# Altium project chassis.PrjPCB
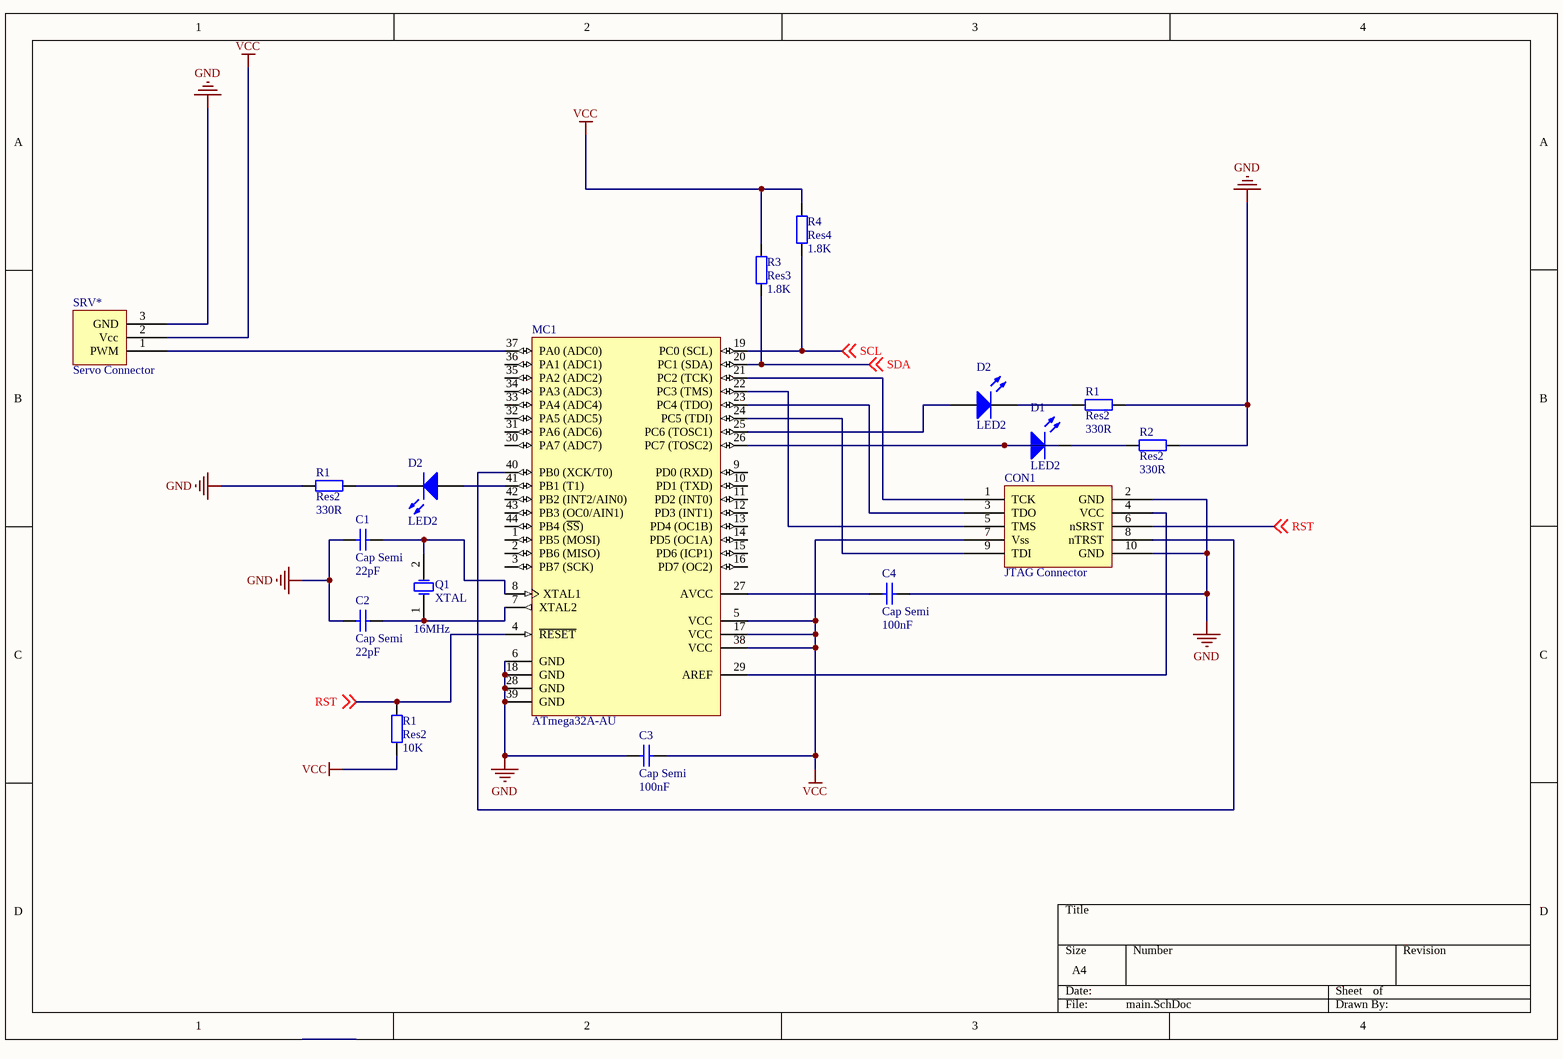
[diagram p0: main.SchDoc]
5 sheets, 60 parts. Net scope: global (net labels, ports and power ports of the same name join across sheets).
Sheets:
  main.SchDoc
  pwm_driver.SchDoc
  adc.SchDoc
  mpu.SchDoc
  main_arm.SchDoc

## Sheet main.SchDoc
size A4

### Parts
(Parts that share a designator on the sheet are numbered #1, #2 ... from top to bottom, then left to right.)
C1#1  Cap Semi  value 22pF  [C1206]
C2#1  Cap Semi  value 22pF  [C1206]
C3#1  Cap Semi  value 100nF  [C1206]
C4#1  Cap Semi  value 100nF  [C1206]
CON1  JTAG Connector
D1  LED2  [3.2X1.6X1.1]
D2#1  LED2  [3.2X1.6X1.1]
D2#2  LED2  [3.2X1.6X1.1]
MC1  ATmega32A-AU  [44A_N]
Q1  XTAL  Freq: 16MHz  [R38]
R1#1  Res2  value 330R  [AXIAL-0.4]
R1#2  Res2  value 330R  [AXIAL-0.4]
R1#3  Res2  value 10K  [AXIAL-0.4]
R2#1  Res2  value 330R  [AXIAL-0.4]
R3  Res3  value 1.8K  [AXIAL-0.4]
R4  Res4  value 1.8K  [AXIAL-0.4]
SRV*  Servo Connector

### Nets
GND: C1#1.1 C2#1.1 C3#1.1 C4#1.2 CON1.2(GND) CON1.10(GND) MC1.6(GND) MC1.18(GND) MC1.28(GND) MC1.39(GND) R1#1.1 R1#2.1 R2#1.1 SRV*.3(GND)
VCC: C3#1.2 CON1.7(Vss) MC1.5(VCC) MC1.17(VCC) MC1.38(VCC) R1#3.1 R3.1 R4.1 SRV*.2(Vcc)
RST: CON1.6(nSRST) MC1.4(~{RESET}) R1#3.2 ; off-sheet RST
SCL: MC1.19(PC0_(SCL)) R4.2 ; off-sheet SCL
SDA: MC1.20(PC1_(SDA)) R3.2 ; off-sheet SDA
NetC1#1_2: C1#1.2 MC1.8(XTAL1) Q1.2(OSC2)
NetC2#1_2: C2#1.2 MC1.7(XTAL2) Q1.1(OSC1)
NetC4#1_1: C4#1.1 MC1.27(AVCC)
NetCON1_1: CON1.1(TCK) MC1.21(PC2_(TCK))
NetCON1_3: CON1.3(TDO) MC1.23(PC4_(TDO))
NetCON1_4: CON1.4(VCC) MC1.29(AREF)
NetCON1_5: CON1.5(TMS) MC1.22(PC3_(TMS))
NetCON1_8: CON1.8(nTRST) MC1.40(PB0_(XCK/T0))
NetCON1_9: CON1.9(TDI) MC1.24(PC5_(TDI))
NetD1_1: D1.1(A) MC1.26(PC7_(TOSC2))
NetD1_2: D1.2(K) R2#1.2
NetD2#1_1: D2#1.1(A) MC1.25(PC6_(TOSC1))
NetD2#1_2: D2#1.2(K) R1#1.2
NetD2#2_1: D2#2.1(A) MC1.41(PB1_(T1))
NetD2#2_2: D2#2.2(K) R1#2.2
NetMC1_37: MC1.37(PA0_(ADC0)) SRV*.1(PWM)

Not connected (* = marked no-connect by the designer): MC1 1(PB5_(MOSI)) 2(PB6_(MISO)) 3(PB7_(SCK)) 9(PD0_(RXD)) 10(PD1_(TXD)) 11(PD2_(INT0)) 12(PD3_(INT1)) 13(PD4_(OC1B)) 14(PD5_(OC1A)) 15(PD6_(ICP1)) 16(PD7_(OC2)) 30(PA7_(ADC7)) 31(PA6_(ADC6)) 32(PA5_(ADC5)) 33(PA4_(ADC4)) 34(PA3_(ADC3)) 35(PA2_(ADC2)) 36(PA1_(ADC1)) 42(PB2_(INT2/AIN0)) 43(PB3_(OC0/AIN1)) 44(PB4_(~{SS}))

### Library data of the parts
C1#1 C2#1 C3#1 C4#1 = Cap Semi: Capacitor (Semiconductor SIM Model); Published: 8-Jun-2000; LatestRevisionDate: 29-May-2009; LatestRevisionNote: IPC-7351 Footprint Added.; PackageReference: C1206; Publisher: Altium Limited; PackageDescription: Chip Capacitor
D1 D2#1 D2#2 = LED2: Typical RED, GREEN, YELLOW, AMBER GaAs LED; Published: 8-Jun-2000; LatestRevisionDate: 17-Jul-2002; LatestRevisionNote: Re-released for DXP Platform.; PackageVersion: Feb-2002; PackageReference: 3.2X1.6X1.1; Publisher: Altium Limited; PackageDescription: SM LED; 2 Flat Leads
MC1 = ATmega32A-AU: 8-bit AVR Microcontroller, 2.7-5.5V, 16MHz, 32KB Flash, 1KB EEPROM, 2KB SRAM, 44-pin TQFP, Industrial Grade (-40°C to 85°C); FUSE bits: CKOPT = 0 , SU = 11 , CKSEL 3:0 = 1111; DatasheetVersion: revC, Feb-2011; PackageVersion: revC, Oct-2010; PackageReference: 44A; PackageDescription: 44-Pin Plastic Thin Profile Quad Flat Pack, 10 x 10 x 1.0 mm Body, 0.8 mm Pitch (TQFP); Code_JEDEC: MS-026-ACB; ComponentLink1Description: Manufacturer URL; ComponentLink1URL: http://www.atmel.com/; ComponentLink2Description: ATmega32A Datasheet; ComponentLink2URL: http://www.atmel.com/dyn/resources/prod_documents/doc8155.pdf; ComponentLink3Description: ATmega32A Summary; ComponentLink3URL: http://www.atmel.com/dyn/resources/prod_documents/8155S.pdf
Q1 = XTAL: Crystal Oscillator; Published: 8-Jun-2000; LatestRevisionDate: 17-Jul-2002; LatestRevisionNote: Re-released for DXP Platform.; PackageReference: R38; Publisher: Altium Limited; PackageDescription: Crystal, Thru-Hole; 2 Leads; Body 3.1 x 8.2 mm (Dia.xH)
R1#1-R1#3 R2#1 R3 R4 = Res2: Resistor; Published: 8-Jun-2000; LatestRevisionDate: 17-Jul-2002; LatestRevisionNote: Re-released for DXP Platform.; PackageReference: AXIAL-0.4; Publisher: Altium Limited; PackageDescription: Axial Device, Thru-Hole; 2 Leads; 0.4 in Pin Spacing

## Sheet pwm_driver.SchDoc
size A4
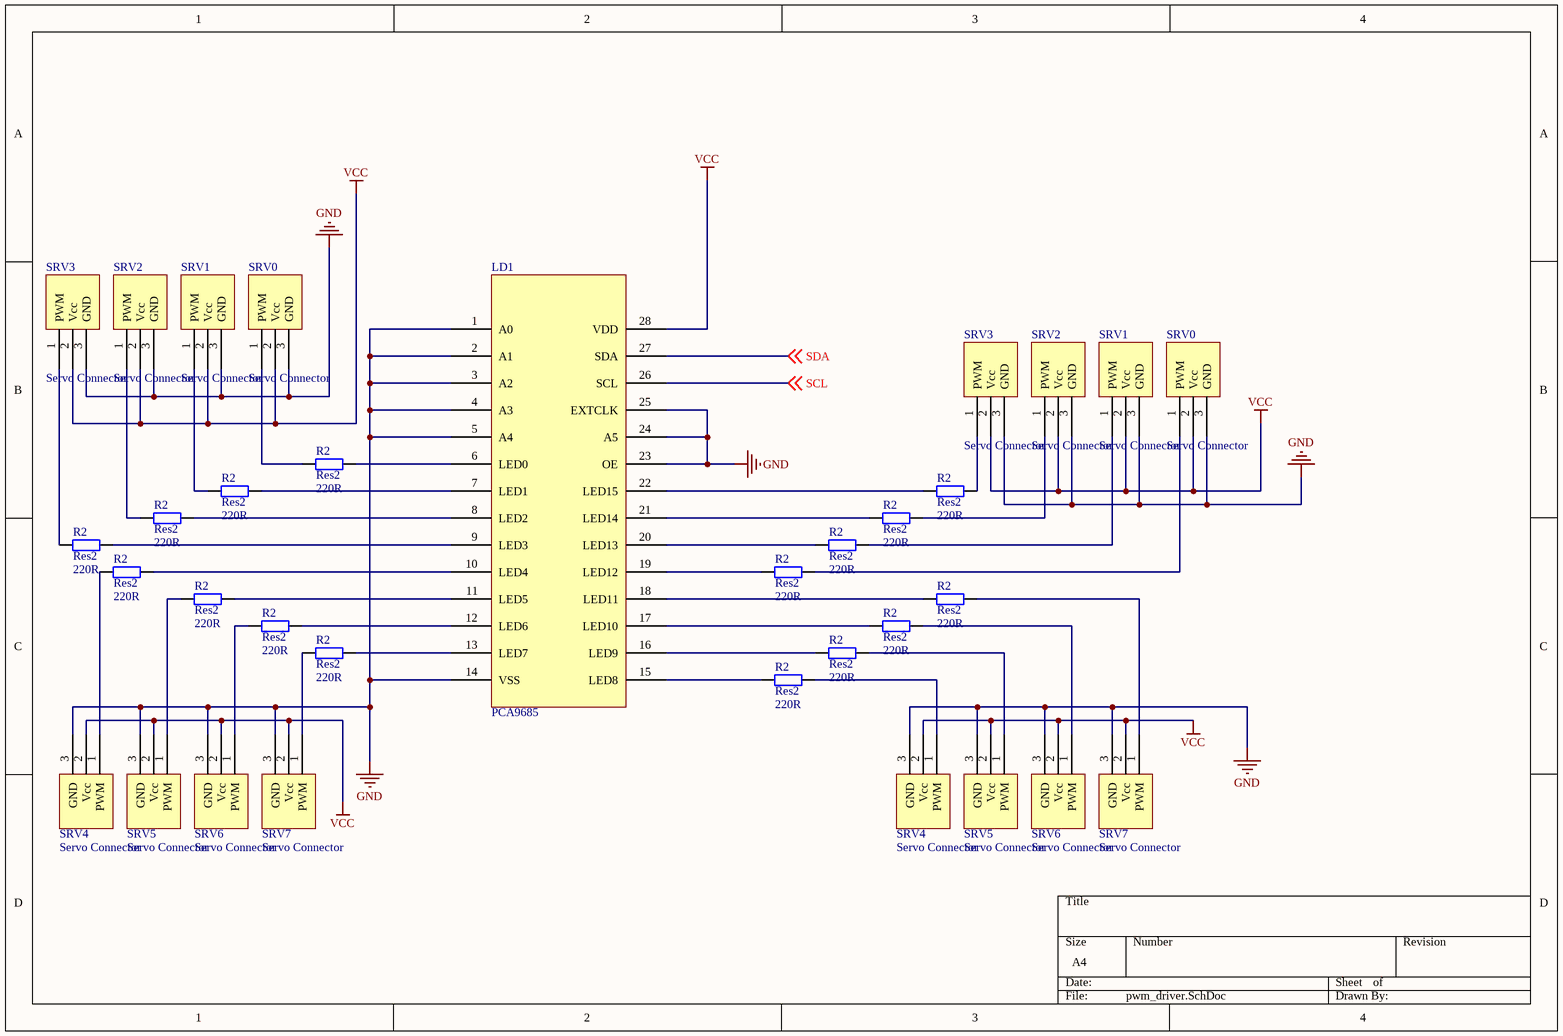
[diagram p1: pwm_driver.SchDoc]

### Parts
(Parts that share a designator on the sheet are numbered #1, #2 ... from top to bottom, then left to right.)
LD1  PCA9685
R2#2  Res2  value 220R  [AXIAL-0.4]
R2#3  Res2  value 220R  [AXIAL-0.4]
R2#4  Res2  value 220R  [AXIAL-0.4]
R2#5  Res2  value 220R  [AXIAL-0.4]
R2#6  Res2  value 220R  [AXIAL-0.4]
R2#7  Res2  value 220R  [AXIAL-0.4]
R2#8  Res2  value 220R  [AXIAL-0.4]
R2#9  Res2  value 220R  [AXIAL-0.4]
R2#10  Res2  value 220R  [AXIAL-0.4]
R2#11  Res2  value 220R  [AXIAL-0.4]
R2#12  Res2  value 220R  [AXIAL-0.4]
R2#13  Res2  value 220R  [AXIAL-0.4]
R2#14  Res2  value 220R  [AXIAL-0.4]
R2#15  Res2  value 220R  [AXIAL-0.4]
R2#16  Res2  value 220R  [AXIAL-0.4]
R2#17  Res2  value 220R  [AXIAL-0.4]
SRV0#1  Servo Connector
SRV0#2  Servo Connector
SRV1#1  Servo Connector
SRV1#2  Servo Connector
SRV2#1  Servo Connector
SRV2#2  Servo Connector
SRV3#1  Servo Connector
SRV3#2  Servo Connector
SRV4#1  Servo Connector
SRV4#2  Servo Connector
SRV5#1  Servo Connector
SRV5#2  Servo Connector
SRV6#1  Servo Connector
SRV6#2  Servo Connector
SRV7#1  Servo Connector
SRV7#2  Servo Connector

### Nets
GND: LD1.1(A0) LD1.2(A1) LD1.3(A2) LD1.4(A3) LD1.5(A4) LD1.14(VSS) LD1.23(OE) LD1.24(A5) LD1.25(EXTCLK) SRV0#1.3(GND) SRV0#2.3(GND) SRV1#1.3(GND) SRV1#2.3(GND) SRV2#1.3(GND) SRV2#2.3(GND) SRV3#1.3(GND) SRV3#2.3(GND) SRV4#1.3(GND) SRV4#2.3(GND) SRV5#1.3(GND) SRV5#2.3(GND) SRV6#1.3(GND) SRV6#2.3(GND) SRV7#1.3(GND) SRV7#2.3(GND)
VCC: LD1.28(VDD) SRV0#1.2(Vcc) SRV0#2.2(Vcc) SRV1#1.2(Vcc) SRV1#2.2(Vcc) SRV2#1.2(Vcc) SRV2#2.2(Vcc) SRV3#1.2(Vcc) SRV3#2.2(Vcc) SRV4#1.2(Vcc) SRV4#2.2(Vcc) SRV5#1.2(Vcc) SRV5#2.2(Vcc) SRV6#1.2(Vcc) SRV6#2.2(Vcc) SRV7#1.2(Vcc) SRV7#2.2(Vcc)
SCL: LD1.26(SCL) ; off-sheet SCL
SDA: LD1.27(SDA) ; off-sheet SDA
NetLD1_6: LD1.6(LED0) R2#2.2
NetLD1_7: LD1.7(LED1) R2#3.2
NetLD1_8: LD1.8(LED2) R2#5.2
NetLD1_9: LD1.9(LED3) R2#7.2
NetLD1_10: LD1.10(LED4) R2#9.2
NetLD1_11: LD1.11(LED5) R2#11.2
NetLD1_12: LD1.12(LED6) R2#13.2
NetLD1_13: LD1.13(LED7) R2#15.2
NetLD1_15: LD1.15(LED8) R2#17.1
NetLD1_16: LD1.16(LED9) R2#16.1
NetLD1_17: LD1.17(LED10) R2#14.1
NetLD1_18: LD1.18(LED11) R2#12.1
NetLD1_19: LD1.19(LED12) R2#10.1
NetLD1_20: LD1.20(LED13) R2#8.1
NetLD1_21: LD1.21(LED14) R2#6.1
NetLD1_22: LD1.22(LED15) R2#4.1
NetR2#2_1: R2#2.1 SRV0#1.1(PWM)
NetR2#3_1: R2#3.1 SRV1#1.1(PWM)
NetR2#4_2: R2#4.2 SRV3#2.1(PWM)
NetR2#5_1: R2#5.1 SRV2#1.1(PWM)
NetR2#6_2: R2#6.2 SRV2#2.1(PWM)
NetR2#7_1: R2#7.1 SRV3#1.1(PWM)
NetR2#8_2: R2#8.2 SRV1#2.1(PWM)
NetR2#9_1: R2#9.1 SRV4#1.1(PWM)
NetR2#10_2: R2#10.2 SRV0#2.1(PWM)
NetR2#11_1: R2#11.1 SRV5#1.1(PWM)
NetR2#12_2: R2#12.2 SRV7#2.1(PWM)
NetR2#13_1: R2#13.1 SRV6#1.1(PWM)
NetR2#14_2: R2#14.2 SRV6#2.1(PWM)
NetR2#15_1: R2#15.1 SRV7#1.1(PWM)
NetR2#16_2: R2#16.2 SRV5#2.1(PWM)
NetR2#17_2: R2#17.2 SRV4#2.1(PWM)

### Notes on the sheet
- (in symbol PCA9685) LED driver

### Library data of the parts
R2#2-R2#17 = Res2: Resistor; Published: 8-Jun-2000; LatestRevisionDate: 17-Jul-2002; LatestRevisionNote: Re-released for DXP Platform.; PackageReference: AXIAL-0.4; Publisher: Altium Limited; PackageDescription: Axial Device, Thru-Hole; 2 Leads; 0.4 in Pin Spacing

## Sheet adc.SchDoc
size A4
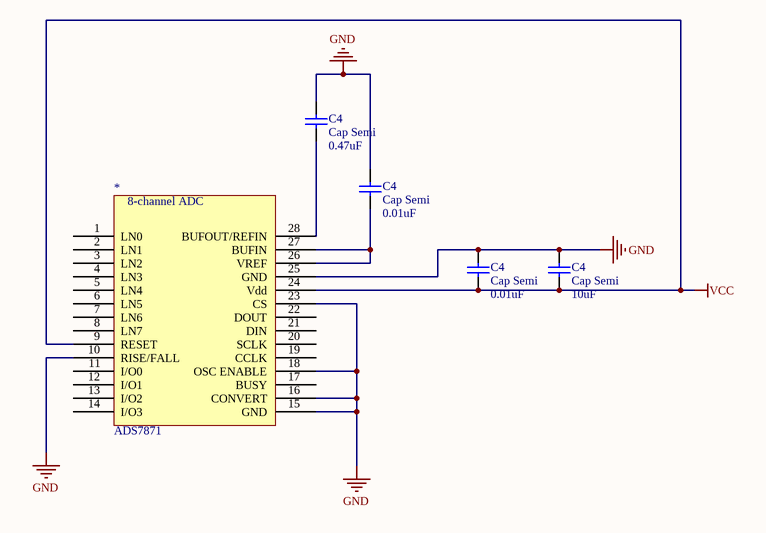
[diagram p2: adc.SchDoc]

### Parts
(Parts that share a designator on the sheet are numbered #1, #2 ... from top to bottom, then left to right.)
*  ADS7871
C4#2  Cap Semi  value 0.47uF  [C1206]
C4#3  Cap Semi  value 0.01uF  [C1206]
C4#4  Cap Semi  value 10uF  [C1206]
C4#5  Cap Semi  value 0.01uF  [C1206]

### Nets
GND: *.10(RISE/FALL) *.15(GND) *.16(CONVERT) *.18(OSC_ENABLE) *.23(CS) *.25(GND) C4#2.1 C4#3.2 C4#4.1 C4#5.2
VCC: *.9(RESET) *.24(Vdd) C4#4.2 C4#5.1
Net*_26: *.26(VREF) *.27(BUFIN) C4#3.1
Net*_28: *.28(BUFOUT/REFIN) C4#2.2

Not connected (* = marked no-connect by the designer): * 1(LN0) 2(LN1) 3(LN2) 4(LN3) 5(LN4) 6(LN5) 7(LN6) 8(LN7) 11(I/O0) 12(I/O1) 13(I/O2) 14(I/O3) 17(BUSY) 19(CCLK) 20(SCLK) 21(DIN) 22(DOUT)

### Notes on the sheet
- (in symbol ADS7871) 8-channel ADC

### Library data of the parts
C4#2-C4#5 = Cap Semi: Capacitor (Semiconductor SIM Model); Published: 8-Jun-2000; LatestRevisionDate: 29-May-2009; LatestRevisionNote: IPC-7351 Footprint Added.; PackageReference: C1206; Publisher: Altium Limited; PackageDescription: Chip Capacitor

## Sheet mpu.SchDoc
size A4
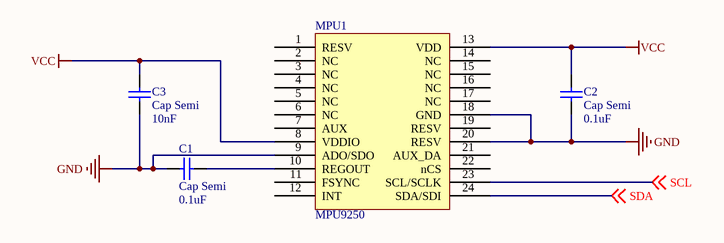
[diagram p3: mpu.SchDoc]

### Parts
(Parts that share a designator on the sheet are numbered #1, #2 ... from top to bottom, then left to right.)
C1#2  Cap Semi  value 0.1uF  [C1206]
C2#2  Cap Semi  value 0.1uF  [C1206]
C3#2  Cap Semi  value 10nF  [C1206]
MPU1  MPU9250

### Nets
GND: C1#2.2 C2#2.1 C3#2.2 MPU1.9(ADO/SDO) MPU1.18(GND) MPU1.20(RESV)
VCC: C2#2.2 C3#2.1 MPU1.8(VDDIO) MPU1.13(VDD)
SCL: MPU1.23(SCL/SCLK) ; off-sheet SCL
SDA: MPU1.24(SDA/SDI) ; off-sheet SDA
NetC1#2_1: C1#2.1 MPU1.10(REGOUT)

Not connected (* = marked no-connect by the designer): MPU1 1(RESV) 2(NC) 3(NC) 4(NC) 5(NC) 6(NC) 7(AUX) 11(FSYNC) 12(INT) 14(NC) 15(NC) 16(NC) 17(NC) 19(RESV) 21(AUX_DA) 22(nCS)

### Library data of the parts
C1#2 C2#2 C3#2 = Cap Semi: Capacitor (Semiconductor SIM Model); Published: 8-Jun-2000; LatestRevisionDate: 29-May-2009; LatestRevisionNote: IPC-7351 Footprint Added.; PackageReference: C1206; Publisher: Altium Limited; PackageDescription: Chip Capacitor

## Sheet main_arm.SchDoc
size A4
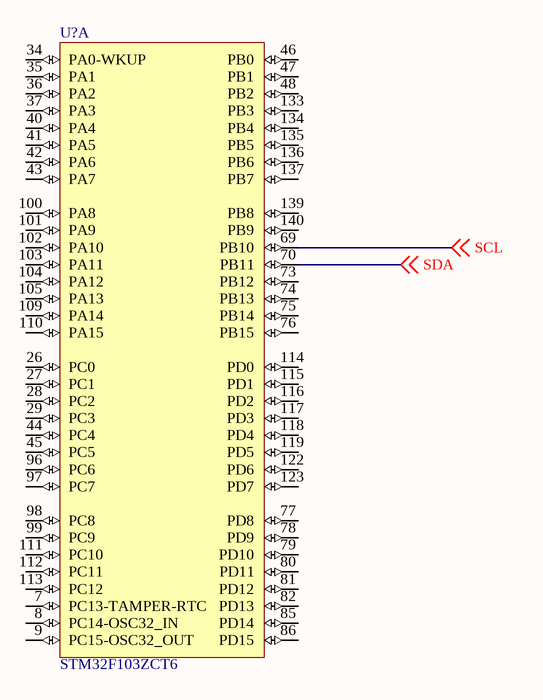
[diagram p4: main_arm.SchDoc]

### Parts
U?  STM32F103ZCT6  [STM-LQFP144_N]  (part A of 3)

### Nets
SCL: U?.69(PB10) ; off-sheet SCL
SDA: U?.70(PB11) ; off-sheet SDA

Not connected (* = marked no-connect by the designer): U? 7(PC13-TAMPER-RTC) 8(PC14-OSC32_IN) 9(PC15-OSC32_OUT) 26(PC0) 27(PC1) 28(PC2) 29(PC3) 34(PA0-WKUP) 35(PA1) 36(PA2) 37(PA3) 40(PA4) 41(PA5) 42(PA6) 43(PA7) 44(PC4) 45(PC5) 46(PB0) 47(PB1) 48(PB2) 73(PB12) 74(PB13) 75(PB14) 76(PB15) 77(PD8) 78(PD9) 79(PD10) 80(PD11) 81(PD12) 82(PD13) 85(PD14) 86(PD15) 96(PC6) 97(PC7) 98(PC8) 99(PC9) 100(PA8) 101(PA9) 102(PA10) 103(PA11) 104(PA12) 105(PA13) 109(PA14) 110(PA15) 111(PC10) 112(PC11) 113(PC12) 114(PD0) 115(PD1) 116(PD2) 117(PD3) 118(PD4) 119(PD5) 122(PD6) 123(PD7) 133(PB3) 134(PB4) 135(PB5) 136(PB6) 137(PB7) 139(PB8) 140(PB9)

### Library data of the parts
U? = STM32F103ZCT6: ARM Cortex-M3 32-bit MCU, 256 KB Flash, 48 KB Internal RAM, 112 I/Os, 144-pin LQFP, -40 to 85 degC, Tray; A/D Converter: 3x12-bit (21 Channel); D/A Converter: 2x12-bit (2 Channel); FLASH Size (Prog) (kB): 256; I/Os (High Current): 112; Internal RAM Size (kB): 48; Operating Frequency(F) (Processor speed) (MHz): 72; Supply Voltage(Vcc) min (V): 2; DatasheetVersion: Rev. 8; PackageVersion: Rev. 4, 06/2013; PackageReference: LQFP144; PackageDescription: 144-Pin Low Profile Quad Flat Package, 20 x 20 mm Body, 0.5 mm Pitch; Supplier 1: Digi-Key; Supplier Part Number 1: 497-11542-ND; Supplier 2: Farnell; Supplier Part Number 2: 1624142; Supplier 3: Newark; Supplier Part Number 3: 57P1265; Supplier 4: Mouser; Supplier Part Number 4: 511-STM32F103ZCT6; Core: ARM Cortex-M3; Packing: Tray; Mounting Technology: Surface Mount; PartNumber: STM32F103ZCT6; ComponentLink1Description: Manufacturer URL; ComponentLink1URL: http://www.st.com/web/en/home.html; ComponentLink2Description: Datasheet; ComponentLink2URL: http://www.st.com/st-web-ui/static/active/en/resource/technical/document/datasheet/CD00191185.pdf; ComponentLink3Description: Package Specification; ComponentLink3URL: http://www.st.com/st-web-ui/static/active/en/resource/technical/document/datasheet/DM00037051.pdf

## Nets that join several sheets
GND: main (14 pins), pwm_driver (25 pins), adc (10 pins), mpu (6 pins)
VCC: main (9 pins), pwm_driver (17 pins), adc (*.9 *.24 C4#4.2 C4#5.1), mpu (C2#2.2 C3#2.1 MPU1.8 MPU1.13)
SCL: main (MC1.19 R4.2), pwm_driver (LD1.26), mpu (MPU1.23), main_arm (U?.69)
SDA: main (MC1.20 R3.2), pwm_driver (LD1.27), mpu (MPU1.24), main_arm (U?.70)